# EasyEDA schematic schematic.json
TITLE: Gateway; REV: 1.0; Date: 2025-12-31; Sheet: 1/1; Drawn By: inocynt.ankohlik; Company: Your Company
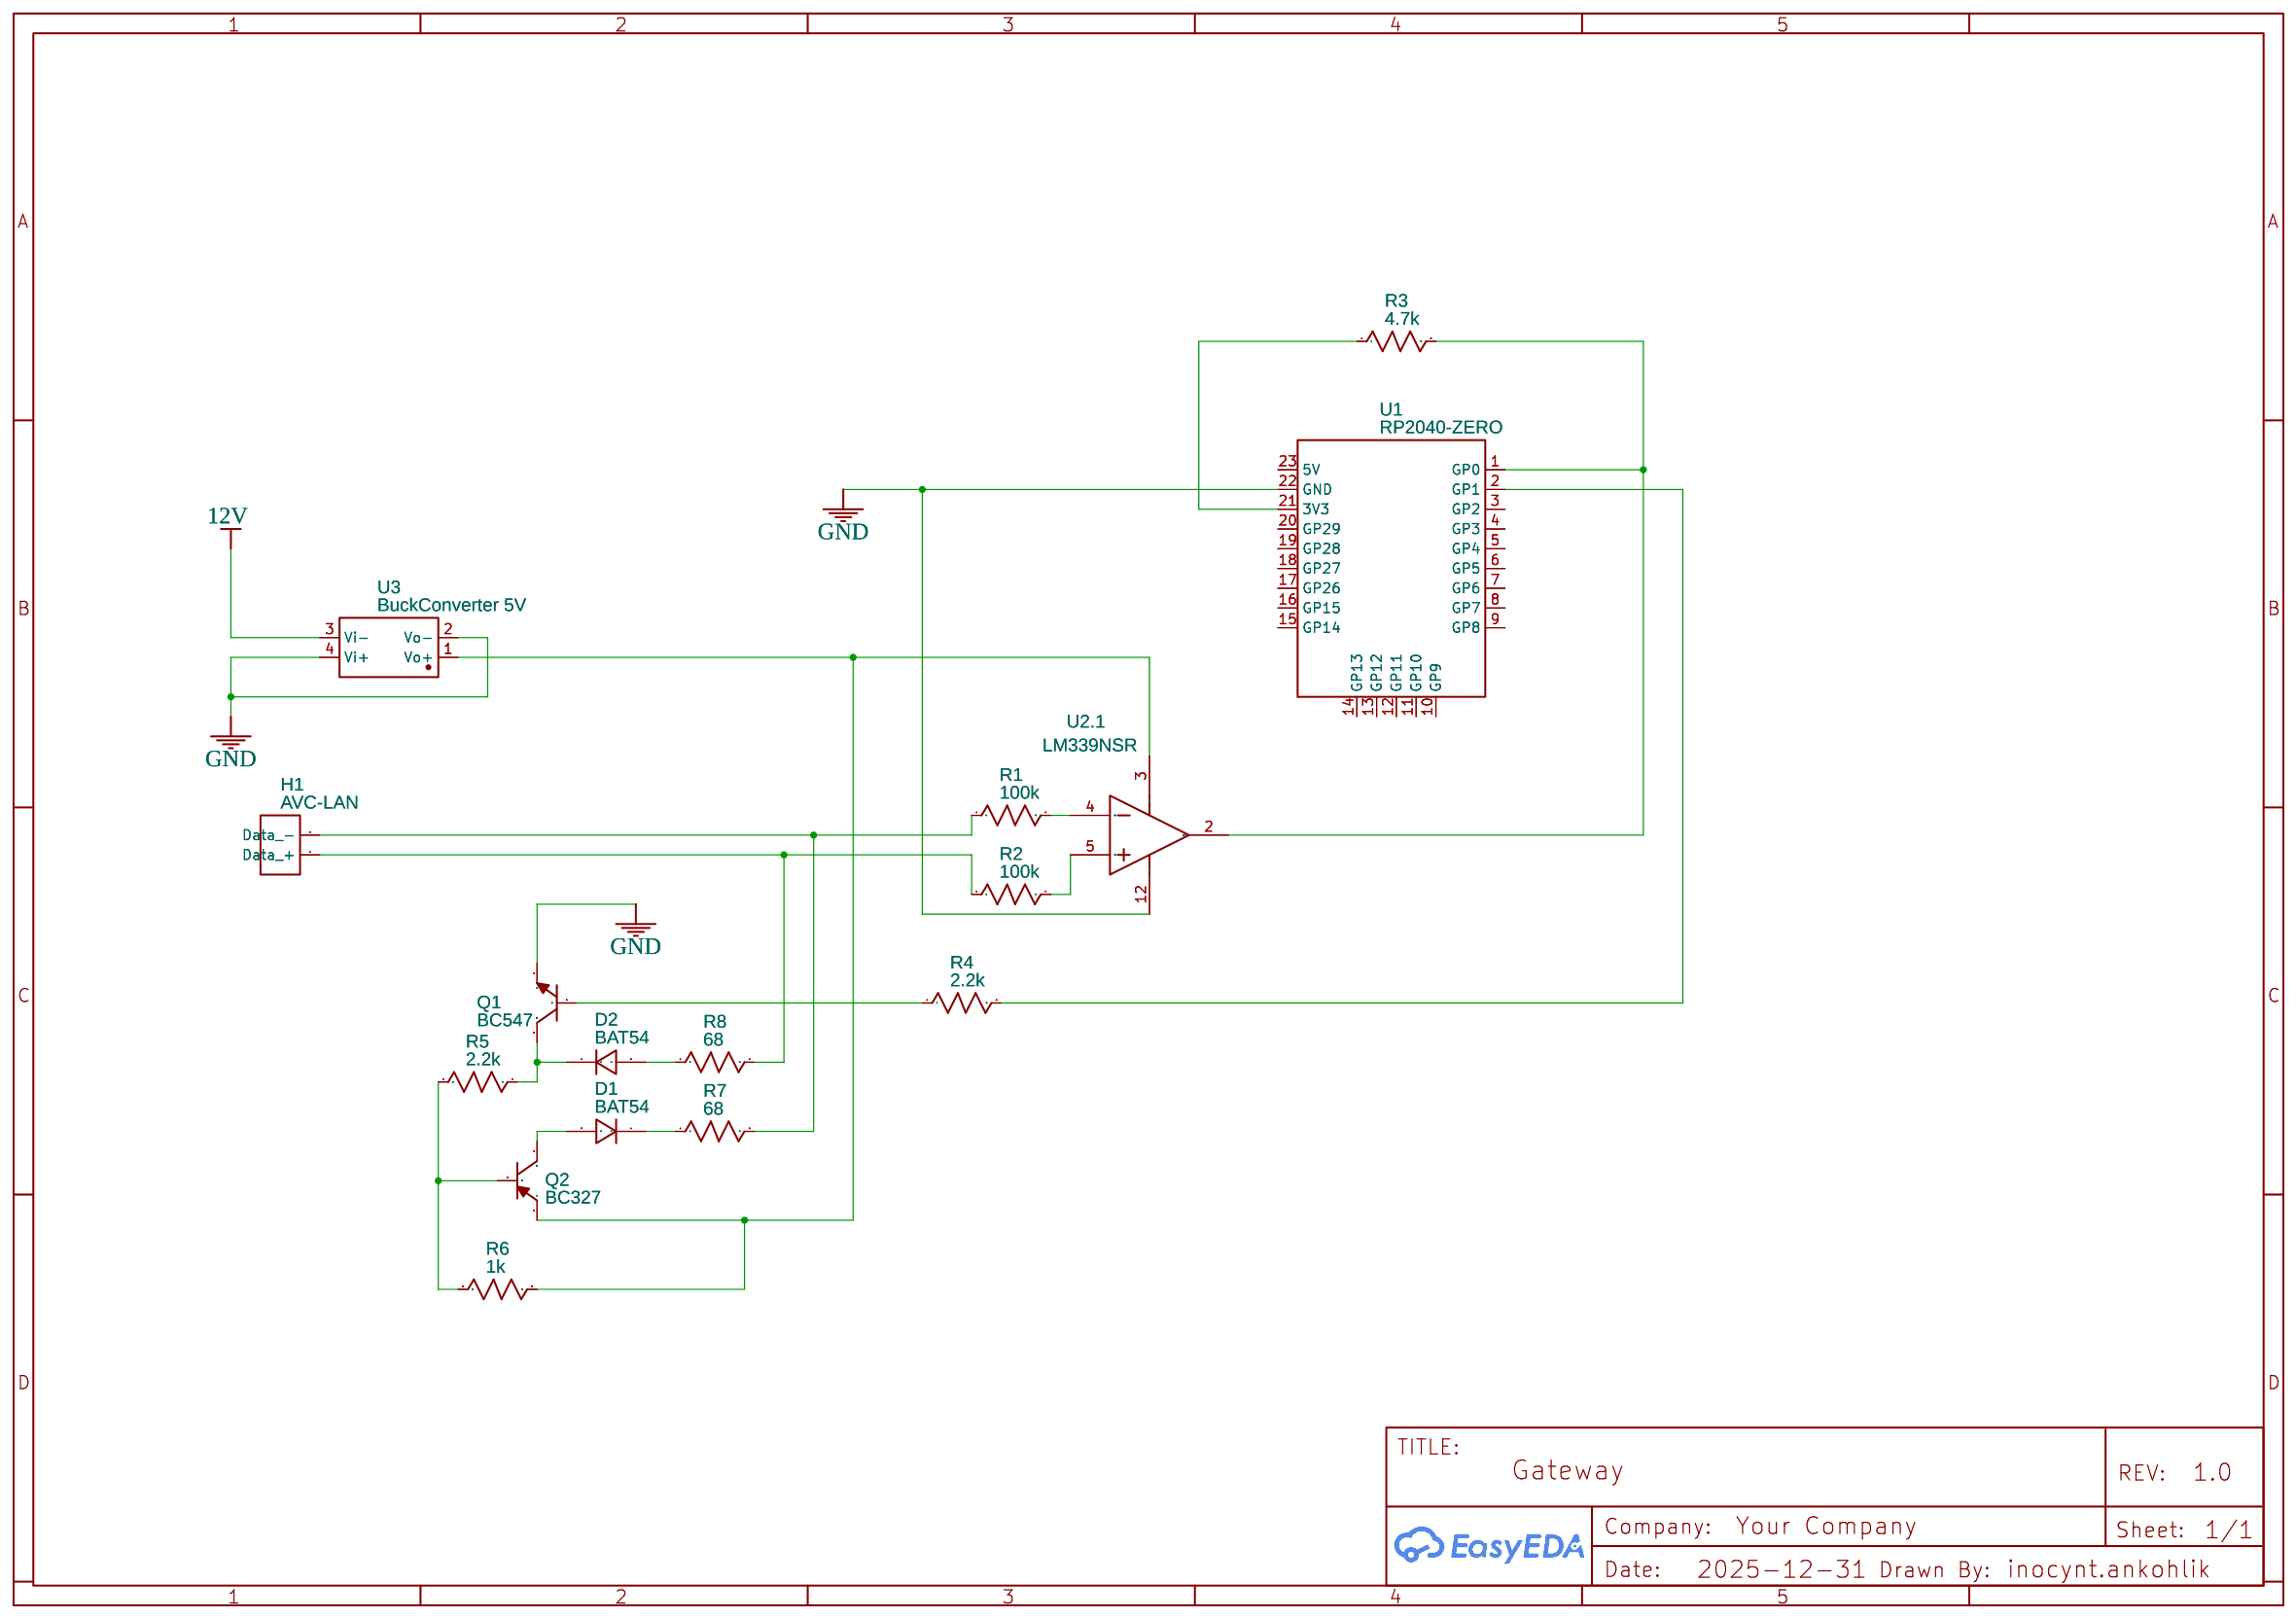
[diagram p0: schematic sheet]

## Parts
D1  BAT54  [SOD-123_L2.8-W1.8-LS3.7-RD]
D2  BAT54  [SOD-123_L2.8-W1.8-LS3.7-RD]
H1  AVC-LAN  [HDR-F-2.54_1X2]
Q1  BC547  [SOT-23-3_L2.9-W1.3-P1.90-LS2.4-TR]
Q2  BC327  [TO-92-3_L4.9-W3.7-P1.27-L]
R1  100k  [R0603]
R2  100k  [R0603]
R3  4.7k  [R0603]
R4  2.2k  [R0603]
R5  2.2k  [R0603]
R6  1k  [R0603]
R7  68  [R0603]
R8  68  [R0603]
U1  RP2040-ZERO  [COMM-SMD_RP2040-ZERO]
U2  LM339NSR  [SOP-14_L10.3-W5.3-P1.27-LS7.8-BL]  (section 1)
U3  BuckConverter 5V  [COMM-SMD_4P-L17.0-W13.0-DM13-5V]

## Library data of the parts
D1 D2 = BAT54: Supplier: LCSC; Contributor: LCEDA_Lib
H1 = HDR-F-2.54_1x2: Supplier Part: C49661; Supplier: LCSC; Contributor: LCEDA_Lib
Q1 = 2N3904(SOT-23): Supplier: LCSC; Manufacturer: KEC; Manufacturer Part: 2n3904S-RTK/PS; Supplier Part: C18536; Paste Type: SOT-23; Contributor: LCEDA_Lib
Q2 = BC327-TA: Contributor: LCSC; Supplier: LCSC; Supplier Part: C2910412; Manufacturer: CJ(江苏长电/长晶)
R1-R8 = R_0603_US: Contributor: LCEDA_Lib
U1 = RP2040-ZERO: Supplier: LCSC; Supplier Part: C5350143; Manufacturer: Waveshare(微雪电子); Manufacturer Part: RP2040-Zero; Contributor: lcsc; JLCPCB Part Class: Extended Part
U2 = LM339NSR: subpart_no: 1; Supplier Part: C68819; Supplier: LCSC; Manufacturer: TI(德州仪器); JLCPCB Part Class: Extended Part
U3 = DM13-5V: Supplier: LCSC; Supplier Part: C9900189571; Manufacturer: null; JLCPCB Part Class: Extended Part; Contributor: lcsc

## Nets
12V: U3.3(Vi-)
GND: Q1.1(E) U1.22(GND) U2.12(GND) U3.2(Vo-) U3.4(Vi+)
Net-(D1-1): D1.1 R7.1
Net-(D1-2): D1.2 Q2.1(C)
Net-(D2-1): D2.1 Q1.3(C) R5.1
Net-(D2-2): D2.2 R8.1
Net-(H1-1): H1.1(Data +) R2.1 R8.2
Net-(H1-2): H1.2(Data -) R1.1 R7.2
Net-(Q1-2): Q1.2(B) R4.1
Net-(Q2-2): Q2.2(B) R5.2 R6.1
Net-(Q2-3): Q2.3(E) R6.2 U2.3(VCC) U3.1(Vo+)
Net-(R1-2): R1.2 U2.4(IN2-)
Net-(R2-2): R2.2 U2.5(IN2+)
Net-(R3-1): R3.1 U1.21(3V3)
Net-(R3-2): R3.2 U1.1(GP0) U2.2(OUT2)
Net-(R4-2): R4.2 U1.2(GP1)

Not connected (* = marked no-connect by the designer): U1 3(GP2) 4(GP3) 5(GP4) 6(GP5) 7(GP6) 8(GP7) 9(GP8) 10(GP9) 11(GP10) 12(GP11) 13(GP12) 14(GP13) 15(GP14) 16(GP15) 17(GP26) 18(GP27) 19(GP28) 20(GP29) 23(5V)
